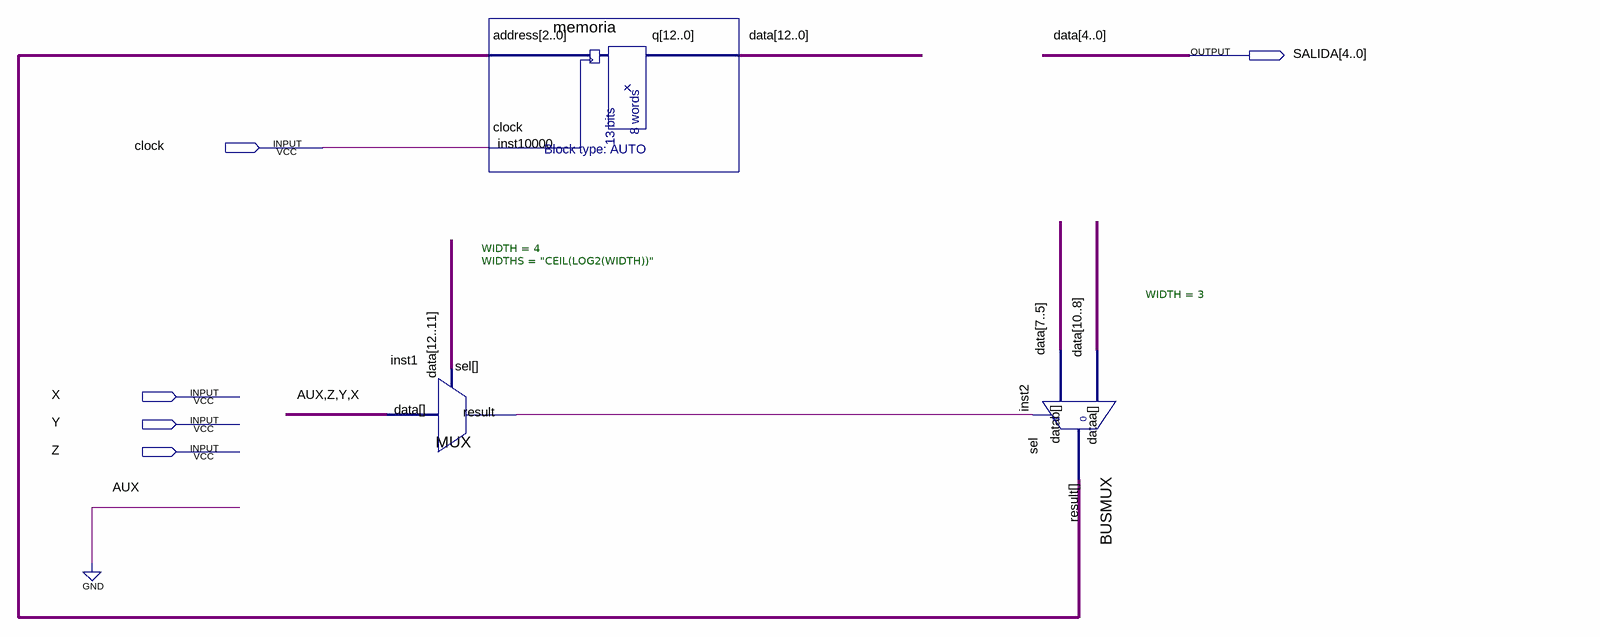
[diagram p0: schematic sheet]
// Quartus schematic cuatro.bdf as structural Verilog: 3 symbols, 5 pins
module cuatro (
  input  clock,
  input  X,
  input  Y,
  input  Z,
  output [4:0] SALIDA
);

  wire inst1_result;
  wire [2:0] inst2_result;
  wire [12:5] data;

  MUX #(.WIDTH(4), .WIDTHS("CEIL(LOG2(WIDTH))")) inst1 (
    .data({1'b0, Z, Y, X}), .sel(data[12:11]), .result(inst1_result));
  memoria inst10000 (.address(inst2_result), .clock(clock), .q({data, SALIDA}));
  BUSMUX #(.WIDTH(3)) inst2 (.datab(data[7:5]), .sel(inst1_result), .dataa(data[10:8]), .result(inst2_result));

  // Other names for the same wires on the sheet: data[4:0] = SALIDA
endmodule
